# Altium schematic sheet CH569W-R0.SchDoc
size 508 x 375 mm
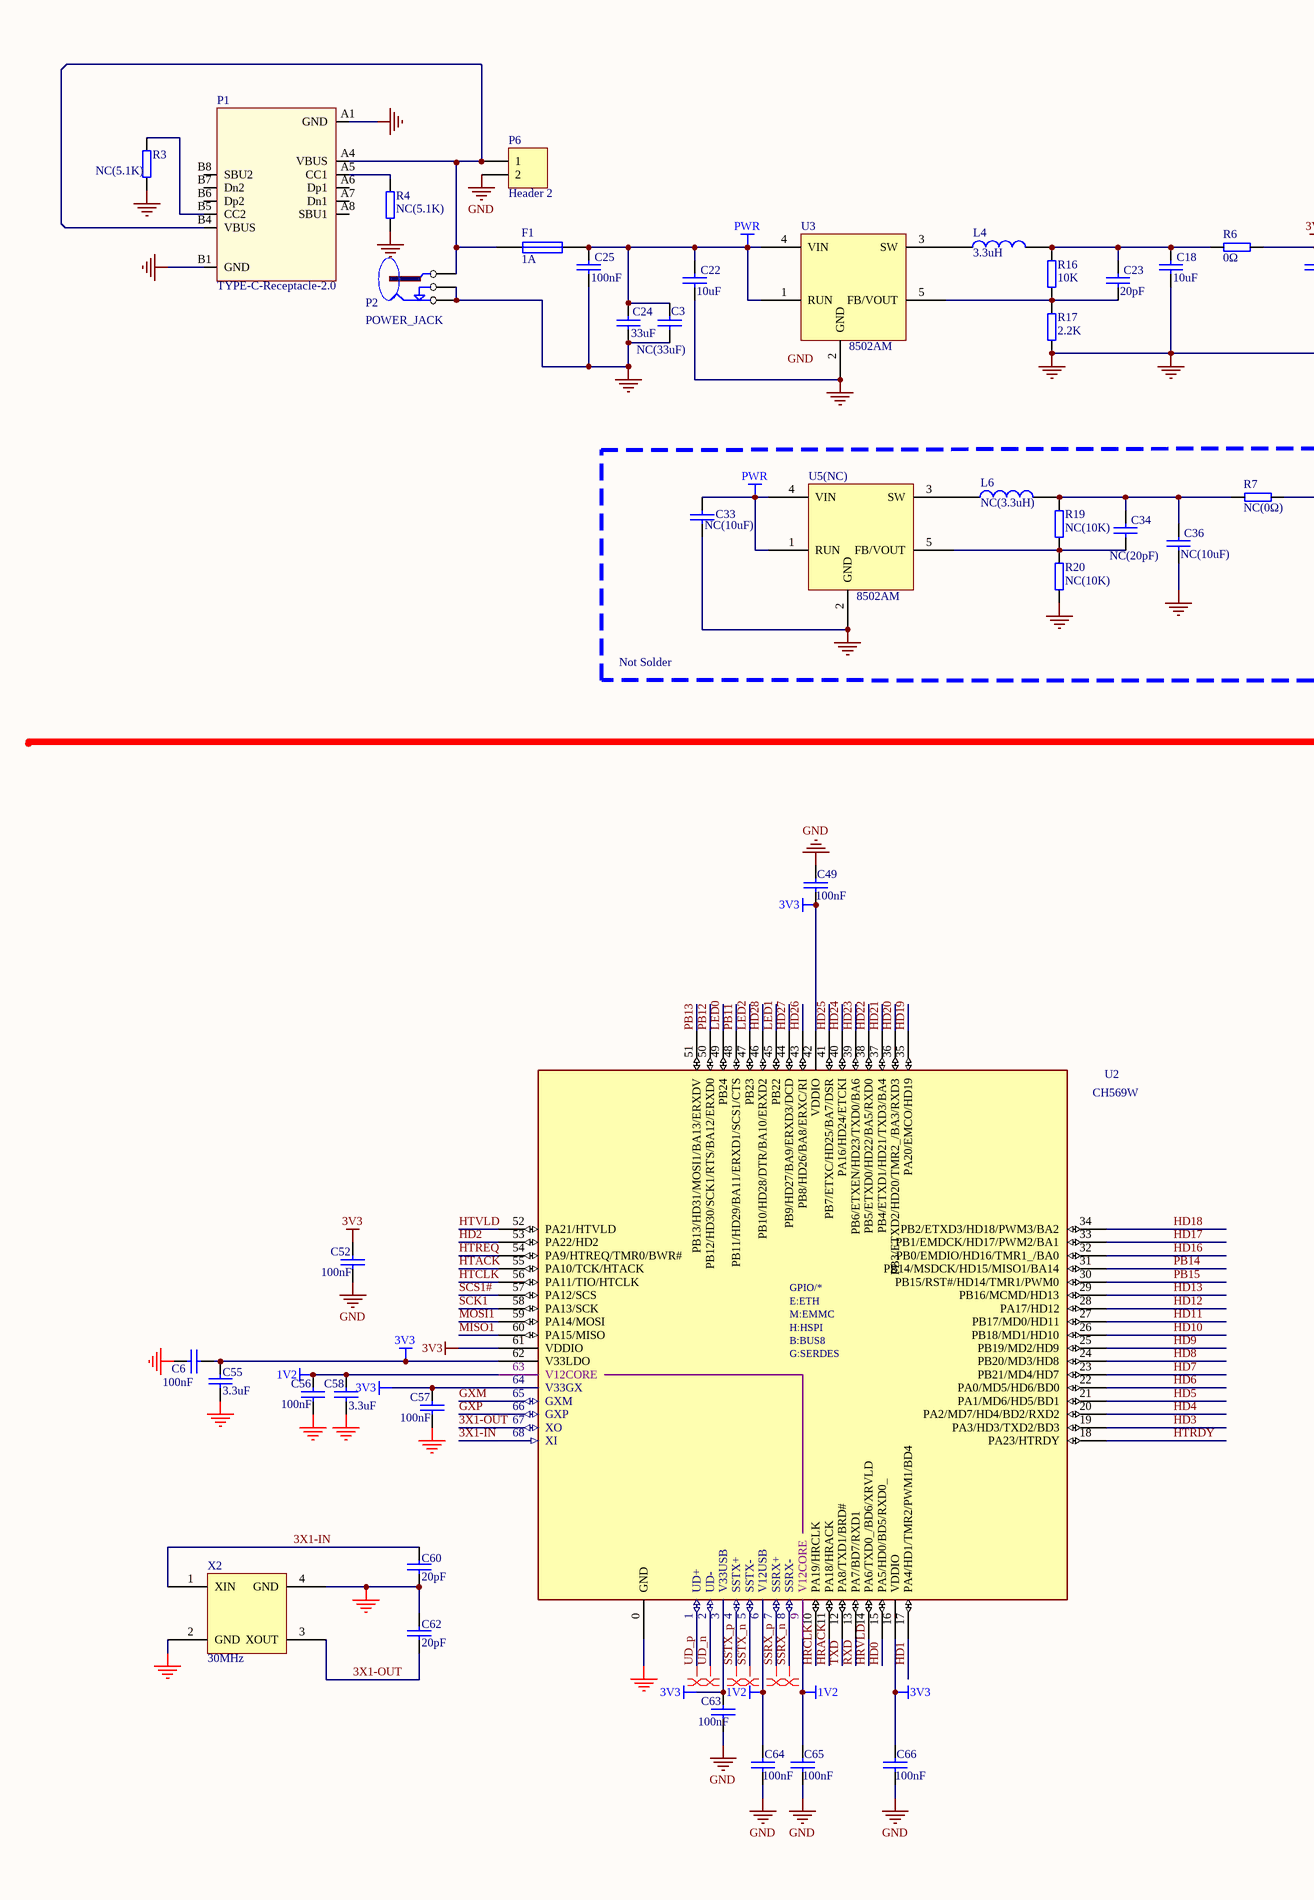
[diagram p0: CH569W-R0.SchDoc, left]
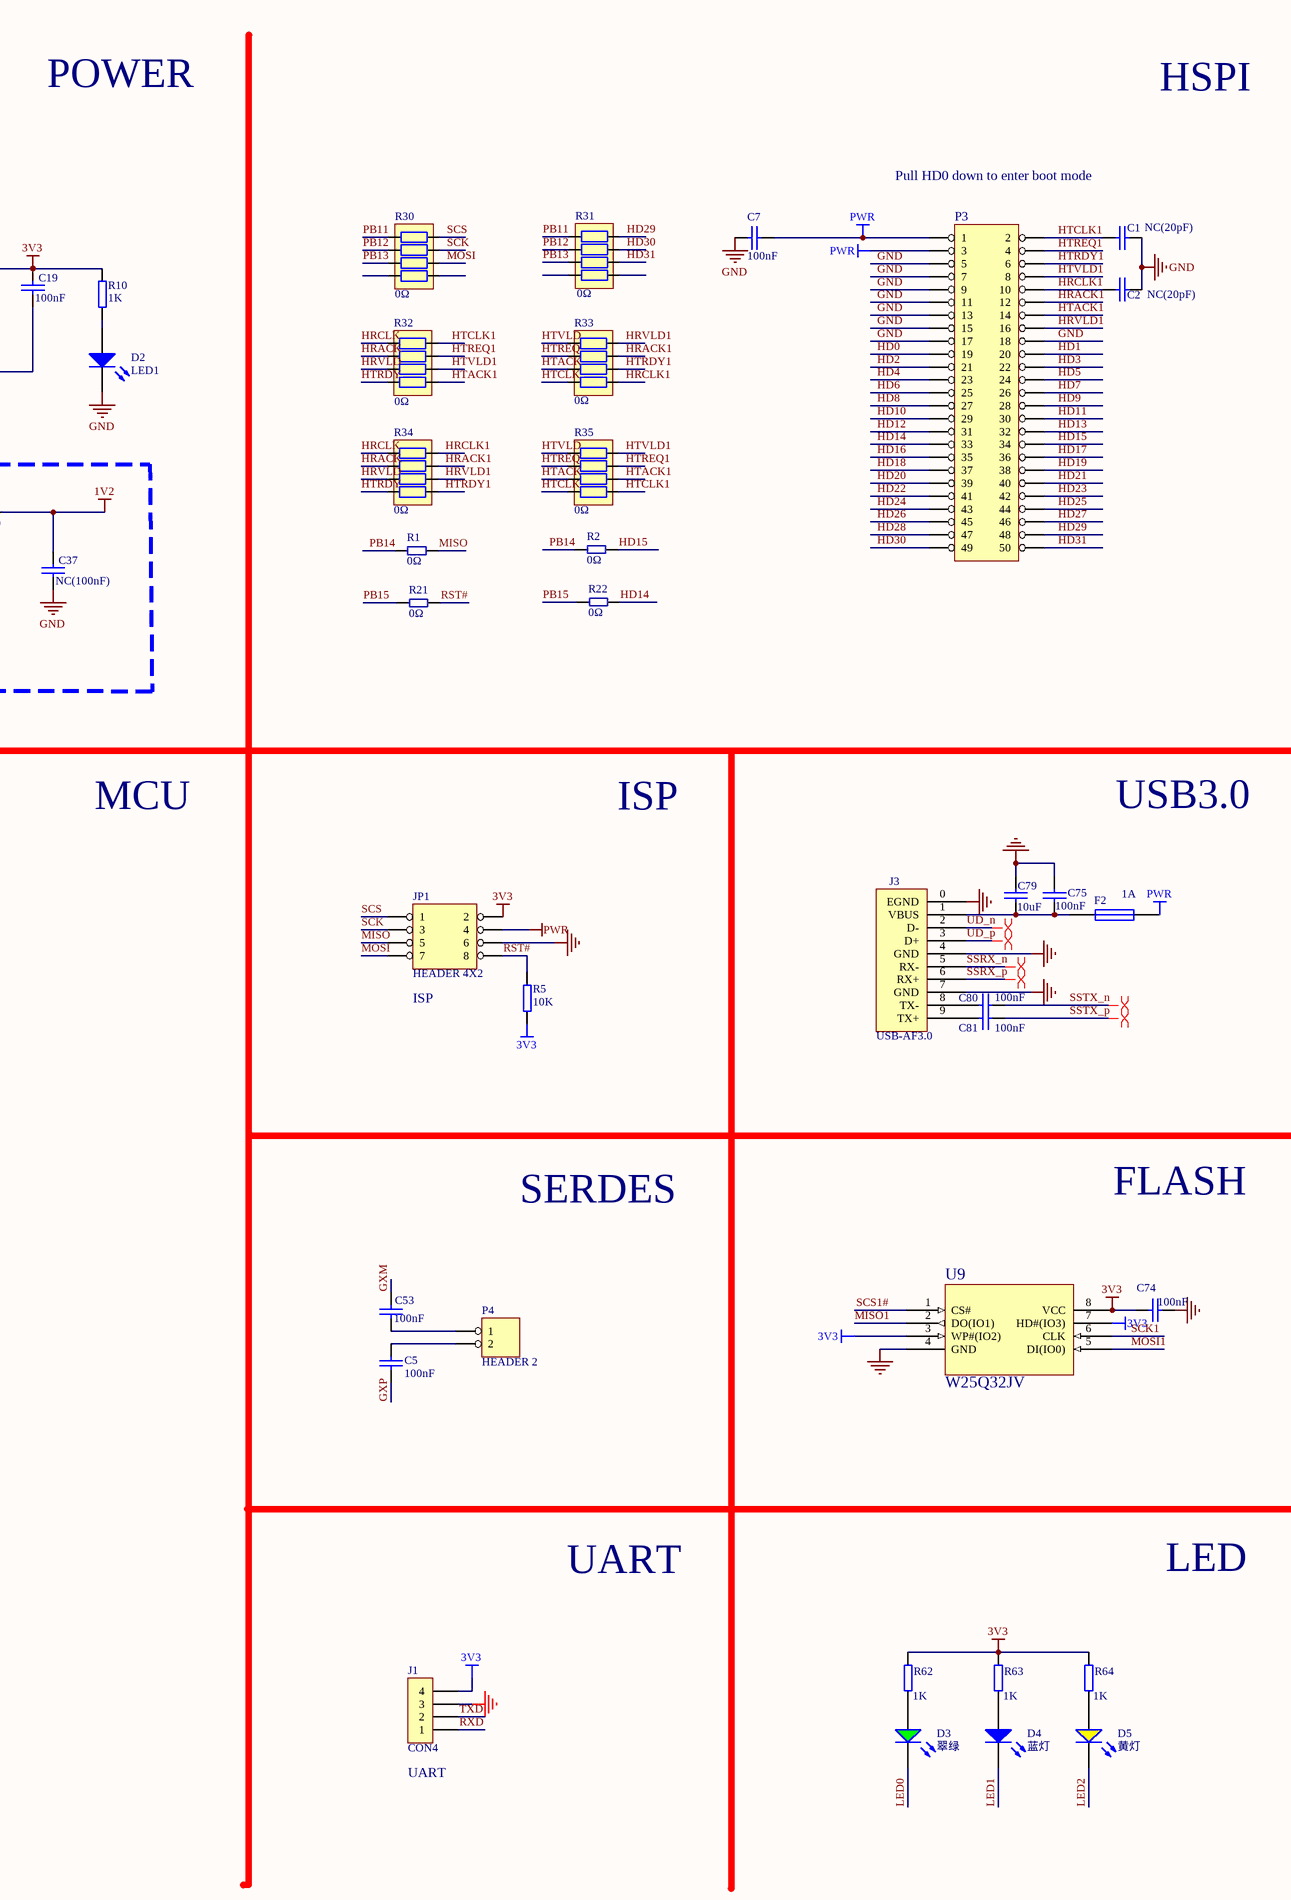
[diagram p1: CH569W-R0.SchDoc, right]

## Parts
C1  NC(20pF)  [0402C]
C2  NC(20pF)  [0402C]
C3  NC(33uF)  [3528]
C5  100nF  [0603C]
C6  100nF  [0603C]
C7  100nF  [0603C]
C18  10uF  [3216]
C19  100nF  [3216]
C22  10uF  [3216]
C23  20pF  [0603C]
C24  33uF  [3528]
C25  100nF  [0603C]
C33  NC(10uF)  [3216]
C34  NC(20pF)  [0603C]
C36  NC(10uF)  [3216]
C37  NC(100nF)  [3216]
C49  100nF  [0603C]
C52  100nF  [0603C]
C53  100nF  [0603C]
C55  3.3uF  [0603C]
C56  100nF  [0603C]
C57  100nF  [0603C]
C58  3.3uF  [0603C]
C60  20pF  [0603C]
C62  20pF  [0603C]
C63  100nF  [0603C]
C64  100nF  [0603C]
C65  100nF  [0603C]
C66  100nF  [0603C]
C74  100nF  [0603C]
C75  100nF  [0603C]
C79  10uF  [3216]
C80  100nF  [C 0402_L]
C81  100nF  [C 0402_L]
D2  LED1  [0805+]
D3  翠绿  [0805+]
D4  蓝灯  [0805+]
D5  黄灯  [0805+]
F1  1A  [0805]
F2  1A  [0805]
J1  CON4  [SIP4-2.54mm]
J3  USB-AF3.0  [USB3.0-Receptacle]
JP1  HEADER 4X2  [IDC8-2.54mm]
L4  3.3uH  [SMD_5x5mm]
L6  NC(3.3uH)  [SMD_5x5mm]
P1  TYPE-C-Receptacle-2.0  [TYPE-C-Receptacle-2.0]
P2  POWER_JACK  [DC-005]
P3  LEFT_P  [IDC50-2.54mm]  (value not drawn)
P4  HEADER 2  [SIP2-2.54mm]
P6  Header 2  [SIP2-2.54mm]
R1  0Ω  [0603]
R2  0Ω  [0603]
R3  NC(5.1K)  [0603]
R4  NC(5.1K)  [0603]
R5  10K  [0603]
R6  0Ω  [0805]
R7  NC(0Ω)  [0805]
R10  1K  [0603]
R16  10K  [0603]
R17  2.2K  [0603]
R19  NC(10K)  [0603]
R20  NC(10K)  [0603]
R21  0Ω  [0603]
R22  0Ω  [0603]
R30  0Ω  [RCA-8P4R-0603]
R31  0Ω  [RCA-8P4R-0603]
R32  0Ω  [RCA-8P4R-0603]
R33  0Ω  [RCA-8P4R-0603]
R34  0Ω  [RCA-8P4R-0603]
R35  0Ω  [RCA-8P4R-0603]
R62  1K  [0603]
R63  1K  [0603]
R64  1K  [0603]
U2  CH569W  [QFN68_8X8]
U3  8502AM  [SOT753]
U5(NC)  8502AM  [SOT753]
U9  W25Q32JV  [SOIC-8_208mil]
X2  30MHz  [3225]

## Blocks framed on the sheet
Not Solder: C33 C34 C36 C37 L6 R7 R19 R20 U5(NC)

## Nets
1V2: C37.2 C56.2 C58.2 C64.2 C65.2 R7.2 U2.6(V12USB) U2.9(V12CORE) U2.63(V12CORE)
3V3: C6.1 C19.2 C49.1 C52.2 C55.2 C57.2 C63.2 C66.2 C74.2 J1.4 JP1.2 R5.2 R6.2 R10.2 R62.2 R63.2 R64.2 U2.3(V33USB) U2.16(VDDIO) U2.42(VDDIO) U2.61(VDDIO) U2.62(V33LDO) U2.64(V33GX) U9.3(WP#(IO2)) U9.7(HD#(IO3)) U9.8(VCC)
GND: C1.1 C2.1 C3.1 C6.2 C7.2 C18.1 C19.1 C22.1 C24.2 C25.1 C33.1 C36.1 C37.1 C49.2 C52.1 C55.1 C56.1 C57.1 C58.1 C60.1 C62.2 C63.1 C64.1 C65.1 C66.1 C74.1 C75.2 C79.2 D2.2(K) J1.3 J3.0(EGND) J3.4(GND) J3.7(GND) JP1.6 P1.A1(GND) P1.B1(GND) P2.2(G) P2.3(X) P3.5 P3.7 P3.9 P3.11 P3.13 P3.15 P3.17 P3.18 P6.2 R3.2 R4.2 R17.1 R20.1 U2.0(GND) U3.2(GND) U5(NC).2(GND) U9.4(GND) X2.2(GND) X2.4(GND)
PWR: C3.2 C7.1 C22.2 C24.1 C25.2 C33.2 F1.2 F2.2 JP1.4 P3.1 P3.3 U3.1(RUN) U3.4(VIN) U5(NC).1(RUN) U5(NC).4(VIN)
3X1-IN: C60.2 U2.68(XI) X2.1(XIN)
3X1-OUT: C62.1 U2.67(XO) X2.3(XOUT)
GXM: C53.1 U2.65(GXM)
GXP: C5.1 U2.66(GXP)
HD0: P3.19 U2.15(PA5/HD0/BD5/RXD0_)
HD1: P3.20 U2.17(PA4/HD1/TMR2/PWM1/BD4)
HD2: P3.21 U2.53(PA22/HD2)
HD3: P3.22 U2.19(PA3/HD3/TXD2/BD3)
HD4: P3.23 U2.20(PA2/MD7/HD4/BD2/RXD2)
HD5: P3.24 U2.21(PA1/MD6/HD5/BD1)
HD6: P3.25 U2.22(PA0/MD5/HD6/BD0)
HD7: P3.26 U2.23(PB21/MD4/HD7)
HD8: P3.27 U2.24(PB20/MD3/HD8)
HD9: P3.28 U2.25(PB19/MD2/HD9)
HD10: P3.29 U2.26(PB18/MD1/HD10)
HD11: P3.30 U2.27(PB17/MD0/HD11)
HD12: P3.31 U2.28(PA17/HD12)
HD13: P3.32 U2.29(PB16/MCMD/HD13)
HD14: P3.33 R22.2
HD15: P3.34 R2.2
HD16: P3.35 U2.32(PB0/EMDIO/HD16/TMR1_/BA0)
HD17: P3.36 U2.33(PB1/EMDCK/HD17/PWM2/BA1)
HD18: P3.37 U2.34(PB2/ETXD3/HD18/PWM3/BA2)
HD19: P3.38 U2.35(PA20/EMCO/HD19)
HD20: P3.39 U2.36(PB3/ETXD2/HD20/TMR2_/BA3/RXD3)
HD21: P3.40 U2.37(PB4/ETXD1/HD21/TXD3/BA4)
HD22: P3.41 U2.38(PB5/ETXD0/HD22/BA5/RXD0)
HD23: P3.42 U2.39(PB6/ETXEN/HD23/TXD0/BA6)
HD24: P3.43 U2.40(PA16/HD24/ETCKI)
HD25: P3.44 U2.41(PB7/ETXC/HD25/BA7/DSR)
HD26: P3.45 U2.43(PB8/HD26/BA8/ERXC/RI)
HD27: P3.46 U2.44(PB9/HD27/BA9/ERXD3/DCD)
HD28: P3.47 U2.46(PB10/HD28/DTR/BA10/ERXD2)
HD29: P3.48 R31.1
HD30: P3.49 R31.2
HD31: P3.50 R31.3
HRACK: R32.7 R34.2 U2.11(PA18/HRACK)
HRACK1: P3.12 R33.3 R34.7
HRCLK: R32.8 R34.1 U2.10(PA19/HRCLK)
HRCLK1: C2.2 P3.10 R33.1 R34.8
HRVLD: R32.6 R34.3 U2.14(PA6/TXD0_/BD6/XRVLD)
HRVLD1: P3.16 R33.4 R34.6
HTACK: R33.7 R35.2 U2.55(PA10/TCK/HTACK)
HTACK1: P3.14 R32.4 R35.7
HTCLK: R33.8 R35.1 U2.56(PA11/TIO/HTCLK)
HTCLK1: C1.2 P3.2 R32.1 R35.8
HTRDY: R32.5 R34.4 U2.18(PA23/HTRDY)
HTRDY1: P3.6 R33.2 R34.5
HTREQ: R33.6 R35.3 U2.54(PA9/HTREQ/TMR0/BWR#)
HTREQ1: P3.4 R32.2 R35.6
HTVLD: R33.5 R35.4 U2.52(PA21/HTVLD)
HTVLD1: P3.8 R32.3 R35.5
LED0: D3.2(K) U2.49(PB24)
LED1: D4.2(K) U2.45(PB22)
LED2: D5.2(K) U2.47(PB23)
MISO: JP1.5 R1.2
MISO1: U2.60(PA15/MISO) U9.2(DO(IO1))
MOSI: JP1.7 R30.6
MOSI1: U2.59(PA14/MOSI) U9.5(DI(IO0))
PB11: R30.1 R31.8 U2.48(PB11/HD29/BA11/ERXD1/SCS1/CTS)
PB12: R30.2 R31.7 U2.50(PB12/HD30/SCK1/RTS/BA12/ERXD0)
PB13: R30.3 R31.6 U2.51(PB13/HD31/MOSI1/BA13/ERXDV)
PB14: R1.1 R2.1 U2.31(PB14/MSDCK/HD15/MISO1/BA14)
PB15: R21.1 R22.1 U2.30(PB15/RST#/HD14/TMR1/PWM0)
RST#: JP1.8 R5.1 R21.2
RXD: J1.1 U2.13(PA7/BD7/RXD1)
SCK: JP1.3 R30.7
SCK1: U2.58(PA13/SCK) U9.6(CLK)
SCS: JP1.1 R30.8
SCS1#: U2.57(PA12/SCS) U9.1(CS#)
SSRX_n: J3.5(RX-) U2.8(SSRX-)
SSRX_p: J3.6(RX+) U2.7(SSRX+)
SSTX_n: C80.1 U2.5(SSTX-)
SSTX_p: C81.1 U2.4(SSTX+)
TXD: J1.2 U2.12(PA8/TXD1/BRD#)
UD_n: J3.2(D-) U2.2(UD-)
UD_p: J3.3(D+) U2.1(UD+)
NetC5_2: C5.2 P4.2
NetC18_2: C18.2 C23.2 L4.2 R6.1 R16.1
NetC23_1: C23.1 R16.2 R17.2 U3.5(FB/VOUT)
NetC34_1: C34.1 R19.2 R20.2 U5(NC).5(FB/VOUT)
NetC34_2: C34.2 C36.2 L6.2 R7.1 R19.1
NetC53_2: C53.2 P4.1
NetC75_1: C75.1 C79.1 F2.1 J3.1(VBUS)
NetC80_2: C80.2 J3.8(TX-)
NetC81_2: C81.2 J3.9(TX+)
NetD2_1: D2.1(A) R10.1
NetD3_1: D3.1(A) R62.1
NetD4_1: D4.1(A) R63.1
NetD5_1: D5.1(A) R64.1
NetF1_1: F1.1 P1.A4(VBUS) P1.B4(VBUS) P2.1(V) P6.1
NetL4_1: L4.1 U3.3(SW)
NetL6_1: L6.1 U5(NC).3(SW)
NetP1_A5: P1.A5(CC1) R4.1
NetP1_B5: P1.B5(CC2) R3.1

Not connected (* = marked no-connect by the designer): P1 A6(Dp1) A7(Dn1) A8(SBU1) B6(Dp2) B7(Dn2) B8(SBU2); R30 4 5; R31 4 5

## Layout directives
differential pair: SSRX_n, SSRX_p, SSTX_n, SSTX_p, UD_n, UD_p

## Notes on the sheet
- POWER
- HSPI
- Pull HD0 down to enter boot mode
- MCU
- ISP
- USB3.0
- (near JP1) ISP
- SERDES
- FLASH
- UART
- LED
- (near J1) UART
- Labels drawn without touching a wire or pin: GND
- (in symbol CH569W) GPIO/*; E:ETH; M:EMMC; H:HSPI; B:BUS8; G:SERDES

## Library data of the parts
C1-C3 C5-C7 C18 C19 C22-C25 C33 C34 C36 C37 C49 C52 C53 C55-C58 C60 C62-C66 C74 C75 C79-C81 = CAP: Capacitor
D2 = LED1: Typical RED GaAs LED; Published: 8-Jun-2000; LatestRevisionDate: 08-Jul-2005; LatestRevisionNote: Mech Layer 1 removed.; PackageReference: LED-1; Publisher: Altium Limited; PackageDescription: LED; 2 Leads
D3 = 0805 翠绿: 发光二极管; ComponentLink1Description: 供应商链接; ComponentLink1URL: http://www.szlcsc.com/product/details_2670.html; Package: 0805; Supplier: LC; SuppliersPartNumber: C2297
D4 = 0805 蓝灯: 发光二极管; ComponentLink1Description: 供应商链接; ComponentLink1URL: http://www.szlcsc.com/product/details_2666.html; Package: 0805; Supplier: LC; SuppliersPartNumber: C2293
D5 = 0805 黄灯: 发光二极管; ComponentLink1Description: 供应商链接; ComponentLink1URL: http://www.szlcsc.com/product/details_2669.html; Package: 0805; Supplier: LC; SuppliersPartNumber: C2296
F1 F2 = FUSE1: Fuse
J1 = CON4: Connector
J3 = USB-AF3.0-90卷
L4 L6 = INDUCTOR
P1 = TYPE-C-Receptacle-2.0: Type-C USB2.0 母座
P3 = HEADER 25X2
P4 = HEADER 2: Header, 2-Pin
P6 = Header 2: Header, 2-Pin; LatestRevisionDate: 17-Jul-2002; LatestRevisionNote: Re-released for DXP Platform.; Publisher: Altium Limited
R1-R5 R10 R16 R17 R19-R22 R62-R64 = R
R6 R7 = RES
R30-R35 = R-8P4R: 贴片网络排阻; 版权归属: 源创客; BOM名称: 贴片网络排阻; 学习资源: www.ooocke.com
U2 = CH569W: 32bit RISC-V MCU with USB 3.0 SS/HS & quad UART & AES & ETH & PIF
X2 = 晶体